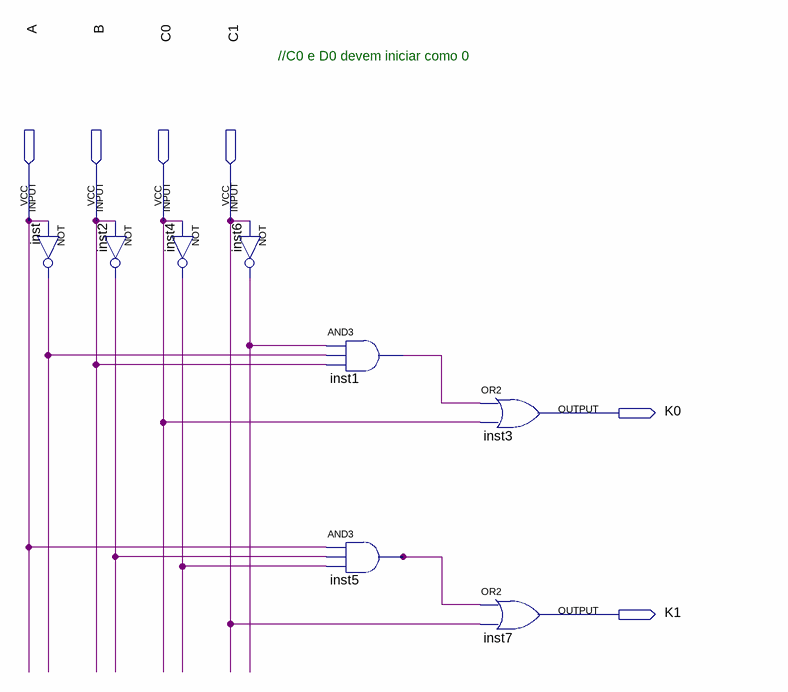
[diagram p0: schematic sheet]
// Quartus schematic Comparador2Bits.bdf as structural Verilog: 8 symbols, 6 pins
module Comparador2Bits (
  input  A,
  input  B,
  input  C0,
  input  C1,
  output K0,
  output K1
);

  wire inst1_out, inst2_out, inst4_out, inst5_out, inst6_out, inst_out;

  not inst (inst_out, A);
  not inst2 (inst2_out, B);
  not inst4 (inst4_out, C0);
  not inst6 (inst6_out, C1);
  and inst1 (inst1_out, inst6_out, inst_out, B);
  and inst5 (inst5_out, A, inst2_out, inst4_out);
  or inst3 (K0, inst1_out, C0);
  or inst7 (K1, inst5_out, C1);

  // Notes on the sheet:
  //   //C0 e D0 devem iniciar como 0
endmodule
